# Altium schematic sheet 15.Raspberry_Pi_Interface.SchDoc
size A4; CheckedBy: YPC; DocumentNumber: 15; Revision: V1.00; SheetNumber: 15; SheetTotal: 18; SheetName: Raspberry_Pi_Interface; SheetDescribe: SheetDescribe; Designer: JOW; DesignDate: 2025-04-25; CheckedData: 2025-04-25; Rule: PcbType=ProtelPcb
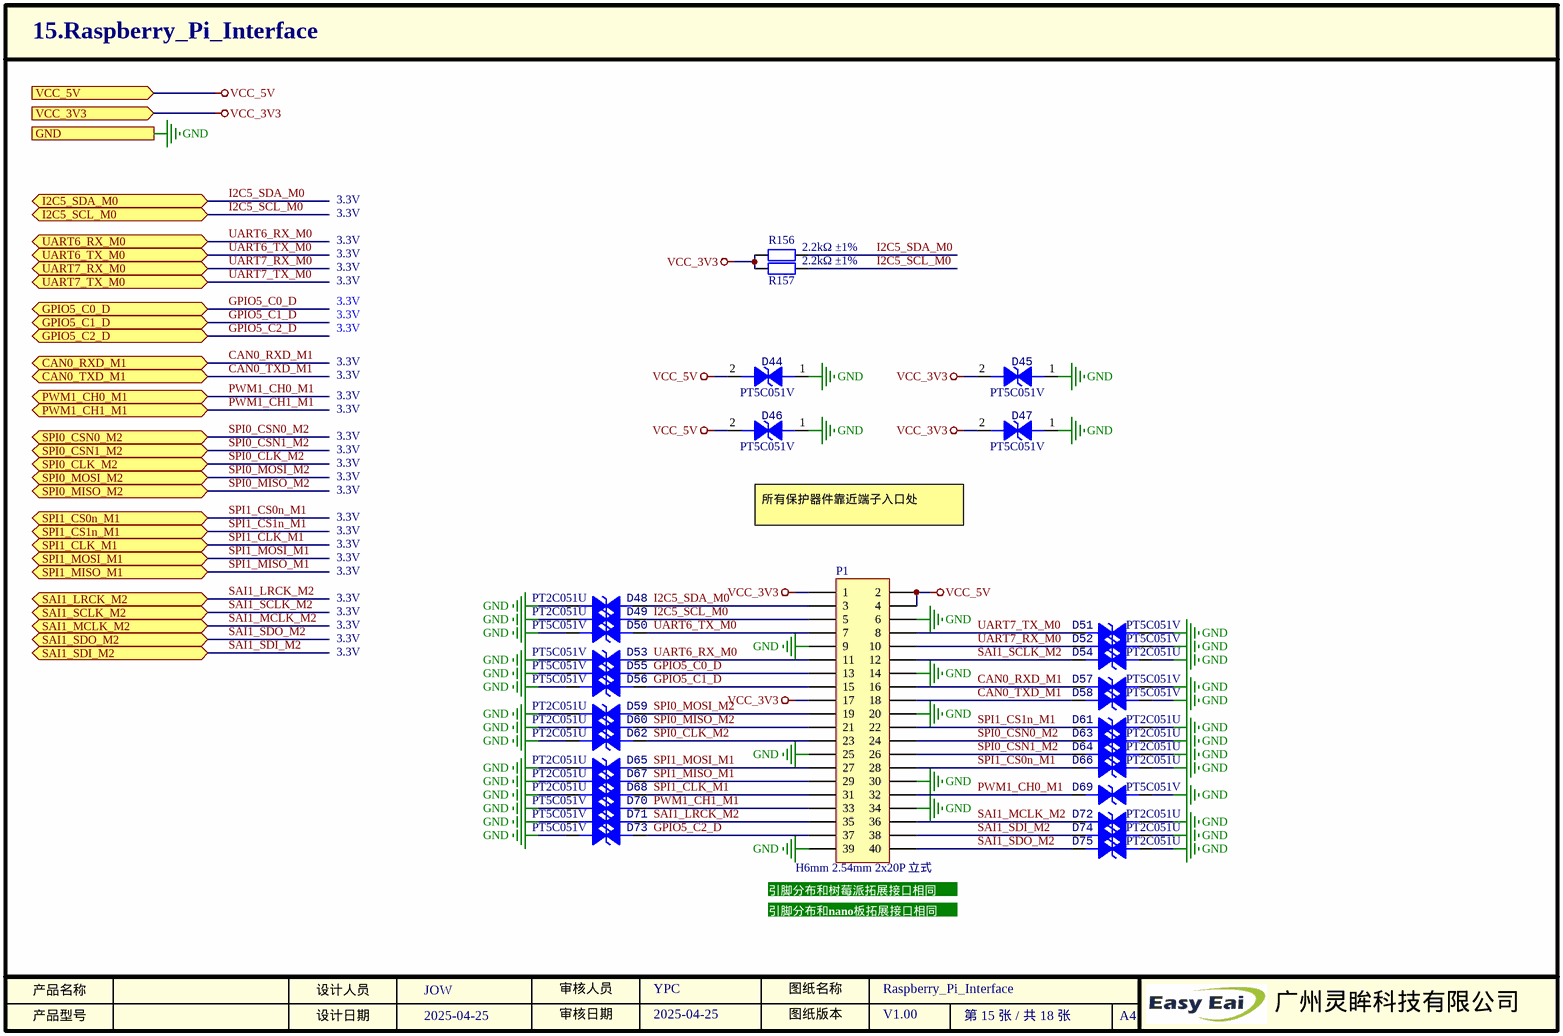
[diagram p0: 15.Raspberry_Pi_Interface.SchDoc]

## Parts
D44  PT5C051V  [SOD-523]
D45  PT5C051V  [SOD-523]
D46  PT5C051V  [SOD-523]
D47  PT5C051V  [SOD-523]
D48  PT2C051U  [DFN1006]
D49  PT2C051U  [DFN1006]
D50  PT5C051V  [SOD-523]
D51  PT5C051V  [SOD-523]
D52  PT5C051V  [SOD-523]
D53  PT5C051V  [SOD-523]
D54  PT2C051U  [DFN1006]
D55  PT5C051V  [SOD-523]
D56  PT5C051V  [SOD-523]
D57  PT5C051V  [SOD-523]
D58  PT5C051V  [SOD-523]
D59  PT2C051U  [DFN1006]
D60  PT2C051U  [DFN1006]
D61  PT2C051U  [DFN1006]
D62  PT2C051U  [DFN1006]
D63  PT2C051U  [DFN1006]
D64  PT2C051U  [DFN1006]
D65  PT2C051U  [DFN1006]
D66  PT2C051U  [DFN1006]
D67  PT2C051U  [DFN1006]
D68  PT2C051U  [DFN1006]
D69  PT5C051V  [SOD-523]
D70  PT5C051V  [SOD-523]
D71  PT5C051V  [SOD-523]
D72  PT2C051U  [DFN1006]
D73  PT5C051V  [SOD-523]
D74  PT2C051U  [DFN1006]
D75  PT2C051U  [DFN1006]
P1  描述: H6mm 2.54mm 2x20P 立式  [HDR-TH_40P-P2.54-V-M-R2-C20-S2.54]  (hidden comment: B-2100S40P-B110)
R156  描述: 2.2kΩ ±1%  [0402_R]  (hidden comment: AC0402FR-072K2L)
R157  描述: 2.2kΩ ±1%  [0402_R]  (hidden comment: AC0402FR-072K2L)

## Ports
CAN0_RXD_M1, CAN0_TXD_M1, GND, GPIO5_C0_D, GPIO5_C1_D, GPIO5_C2_D, I2C5_SCL_M0, I2C5_SDA_M0, PWM1_CH0_M1, PWM1_CH1_M1, SAI1_LRCK_M2, SAI1_MCLK_M2, SAI1_SCLK_M2, SAI1_SDI_M2, SAI1_SDO_M2, SPI0_CLK_M2, SPI0_CSN0_M2, SPI0_CSN1_M2, SPI0_MISO_M2, SPI0_MOSI_M2, SPI1_CLK_M1, SPI1_CS0n_M1, SPI1_CS1n_M1, SPI1_MISO_M1, SPI1_MOSI_M1, UART6_RX_M0, UART6_TX_M0, UART7_RX_M0, UART7_TX_M0, VCC_3V3 (in), VCC_5V (in)

## Nets
GND: D44.1 D45.1 D46.1 D47.1 D48.1 D49.1 D50.1 D51.1 D52.1 D53.1 D54.2 D55.1 D56.1 D57.1 D58.1 D59.1 D60.1 D61.2 D62.1 D63.2 D64.2 D65.1 D66.2 D67.1 D68.1 D69.1 D70.1 D71.1 D72.2 D73.1 D74.2 D75.2 P1.6 P1.9 P1.14 P1.20 P1.25 P1.30 P1.34 P1.39 ; port GND
VCC_3V3: D45.2 D47.2 P1.1 P1.17 R156.1 R157.1 ; port VCC_3V3
VCC_5V: D44.2 D46.2 P1.2 P1.4 ; port VCC_5V
CAN0_RXD_M1: D57.2 P1.16 ; port CAN0_RXD_M1
CAN0_TXD_M1: D58.2 P1.18 ; port CAN0_TXD_M1
GPIO5_C0_D: D55.2 P1.13 ; port GPIO5_C0_D
GPIO5_C1_D: D56.2 P1.15 ; port GPIO5_C1_D
GPIO5_C2_D: D73.2 P1.37 ; port GPIO5_C2_D
I2C5_SCL_M0: D49.2 P1.5 R157.2 ; port I2C5_SCL_M0
I2C5_SDA_M0: D48.2 P1.3 R156.2 ; port I2C5_SDA_M0
PWM1_CH0_M1: D69.2 P1.32 ; port PWM1_CH0_M1
PWM1_CH1_M1: D70.2 P1.33 ; port PWM1_CH1_M1
SAI1_LRCK_M2: D71.2 P1.35 ; port SAI1_LRCK_M2
SAI1_MCLK_M2: D72.1 P1.36 ; port SAI1_MCLK_M2
SAI1_SCLK_M2: D54.1 P1.12 ; port SAI1_SCLK_M2
SAI1_SDI_M2: D74.1 P1.38 ; port SAI1_SDI_M2
SAI1_SDO_M2: D75.1 P1.40 ; port SAI1_SDO_M2
SPI0_CLK_M2: D62.2 P1.23 ; port SPI0_CLK_M2
SPI0_CSN0_M2: D63.1 P1.24 ; port SPI0_CSN0_M2
SPI0_CSN1_M2: D64.1 P1.26 ; port SPI0_CSN1_M2
SPI0_MISO_M2: D60.2 P1.21 ; port SPI0_MISO_M2
SPI0_MOSI_M2: D59.2 P1.19 ; port SPI0_MOSI_M2
SPI1_CLK_M1: D68.2 P1.31 ; port SPI1_CLK_M1
SPI1_CS0n_M1: D66.1 P1.28 ; port SPI1_CS0n_M1
SPI1_CS1n_M1: D61.1 P1.22 ; port SPI1_CS1n_M1
SPI1_MISO_M1: D67.2 P1.29 ; port SPI1_MISO_M1
SPI1_MOSI_M1: D65.2 P1.27 ; port SPI1_MOSI_M1
UART6_RX_M0: D53.2 P1.11 ; port UART6_RX_M0
UART6_TX_M0: D50.2 P1.7 ; port UART6_TX_M0
UART7_RX_M0: D52.2 P1.10 ; port UART7_RX_M0
UART7_TX_M0: D51.2 P1.8 ; port UART7_TX_M0

## Notes on the sheet
- 3.3V
- 所有保护器件靠近端子入口处
- (near P1) 引脚分布和树莓派拓展接口相同
- 引脚分布和nano板拓展接口相同
- 产品名称
- 产品型号
- 设计人员
- 设计日期
- 审核人员
- 审核日期
- 图纸版本
- 图纸名称
- A4
- 广州灵眸科技有限公司

## Library data of the parts
D44-D47 D50-D53 D55-D58 D69-D71 D73 = PT5C051V: SPZL001155; 名称: ESD; 贴片和直插: SMD; 厂商: 玛珂斯科技; 描述: Vrwm=5V,Vc=25V,Ipp=5A; 工作温度: -55~125℃; 封装: SOD-523; 商品编号: SPZL001155; 型号: PT5C051V
D48 D49 D54 D59-D68 D72 D74 D75 = PT2C051U: SPZL001147; 名称: ESD; 贴片和直插: SMD; 厂商: 玛珂斯科技; 描述: Vrwm=5V, Cj=0.3pF; 工作温度: -55~125℃; 封装: DFN1006; 商品编号: SPZL001147; 型号: PT2C051U
P1 = 排针 H6mm 2.54mm 2x20P 立式: SPZL000147; 名称: 排针; 封装: 插件,P=2.54mm; 贴片和直插: THT; 厂商: Ckmtw(灿科盟); 工作温度: -40~105℃; 型号: B-2100S40P-B110; 商品编号: SPZL000147; SuppliersPartNumber: C124383
R156 R157 = 0402 2.2kΩ ±1%: SPZL000307; 封装: 0402; 厂商: YAGEO(国巨); 贴片和直插: SMD; 名称: 电阻; 工作温度: -55~155℃; SuppliersPartNumber: C144773; 型号: AC0402FR-072K2L; 商品编号: SPZL000307